# Altium project SVEC.PrjPcb (part 11 of 11)
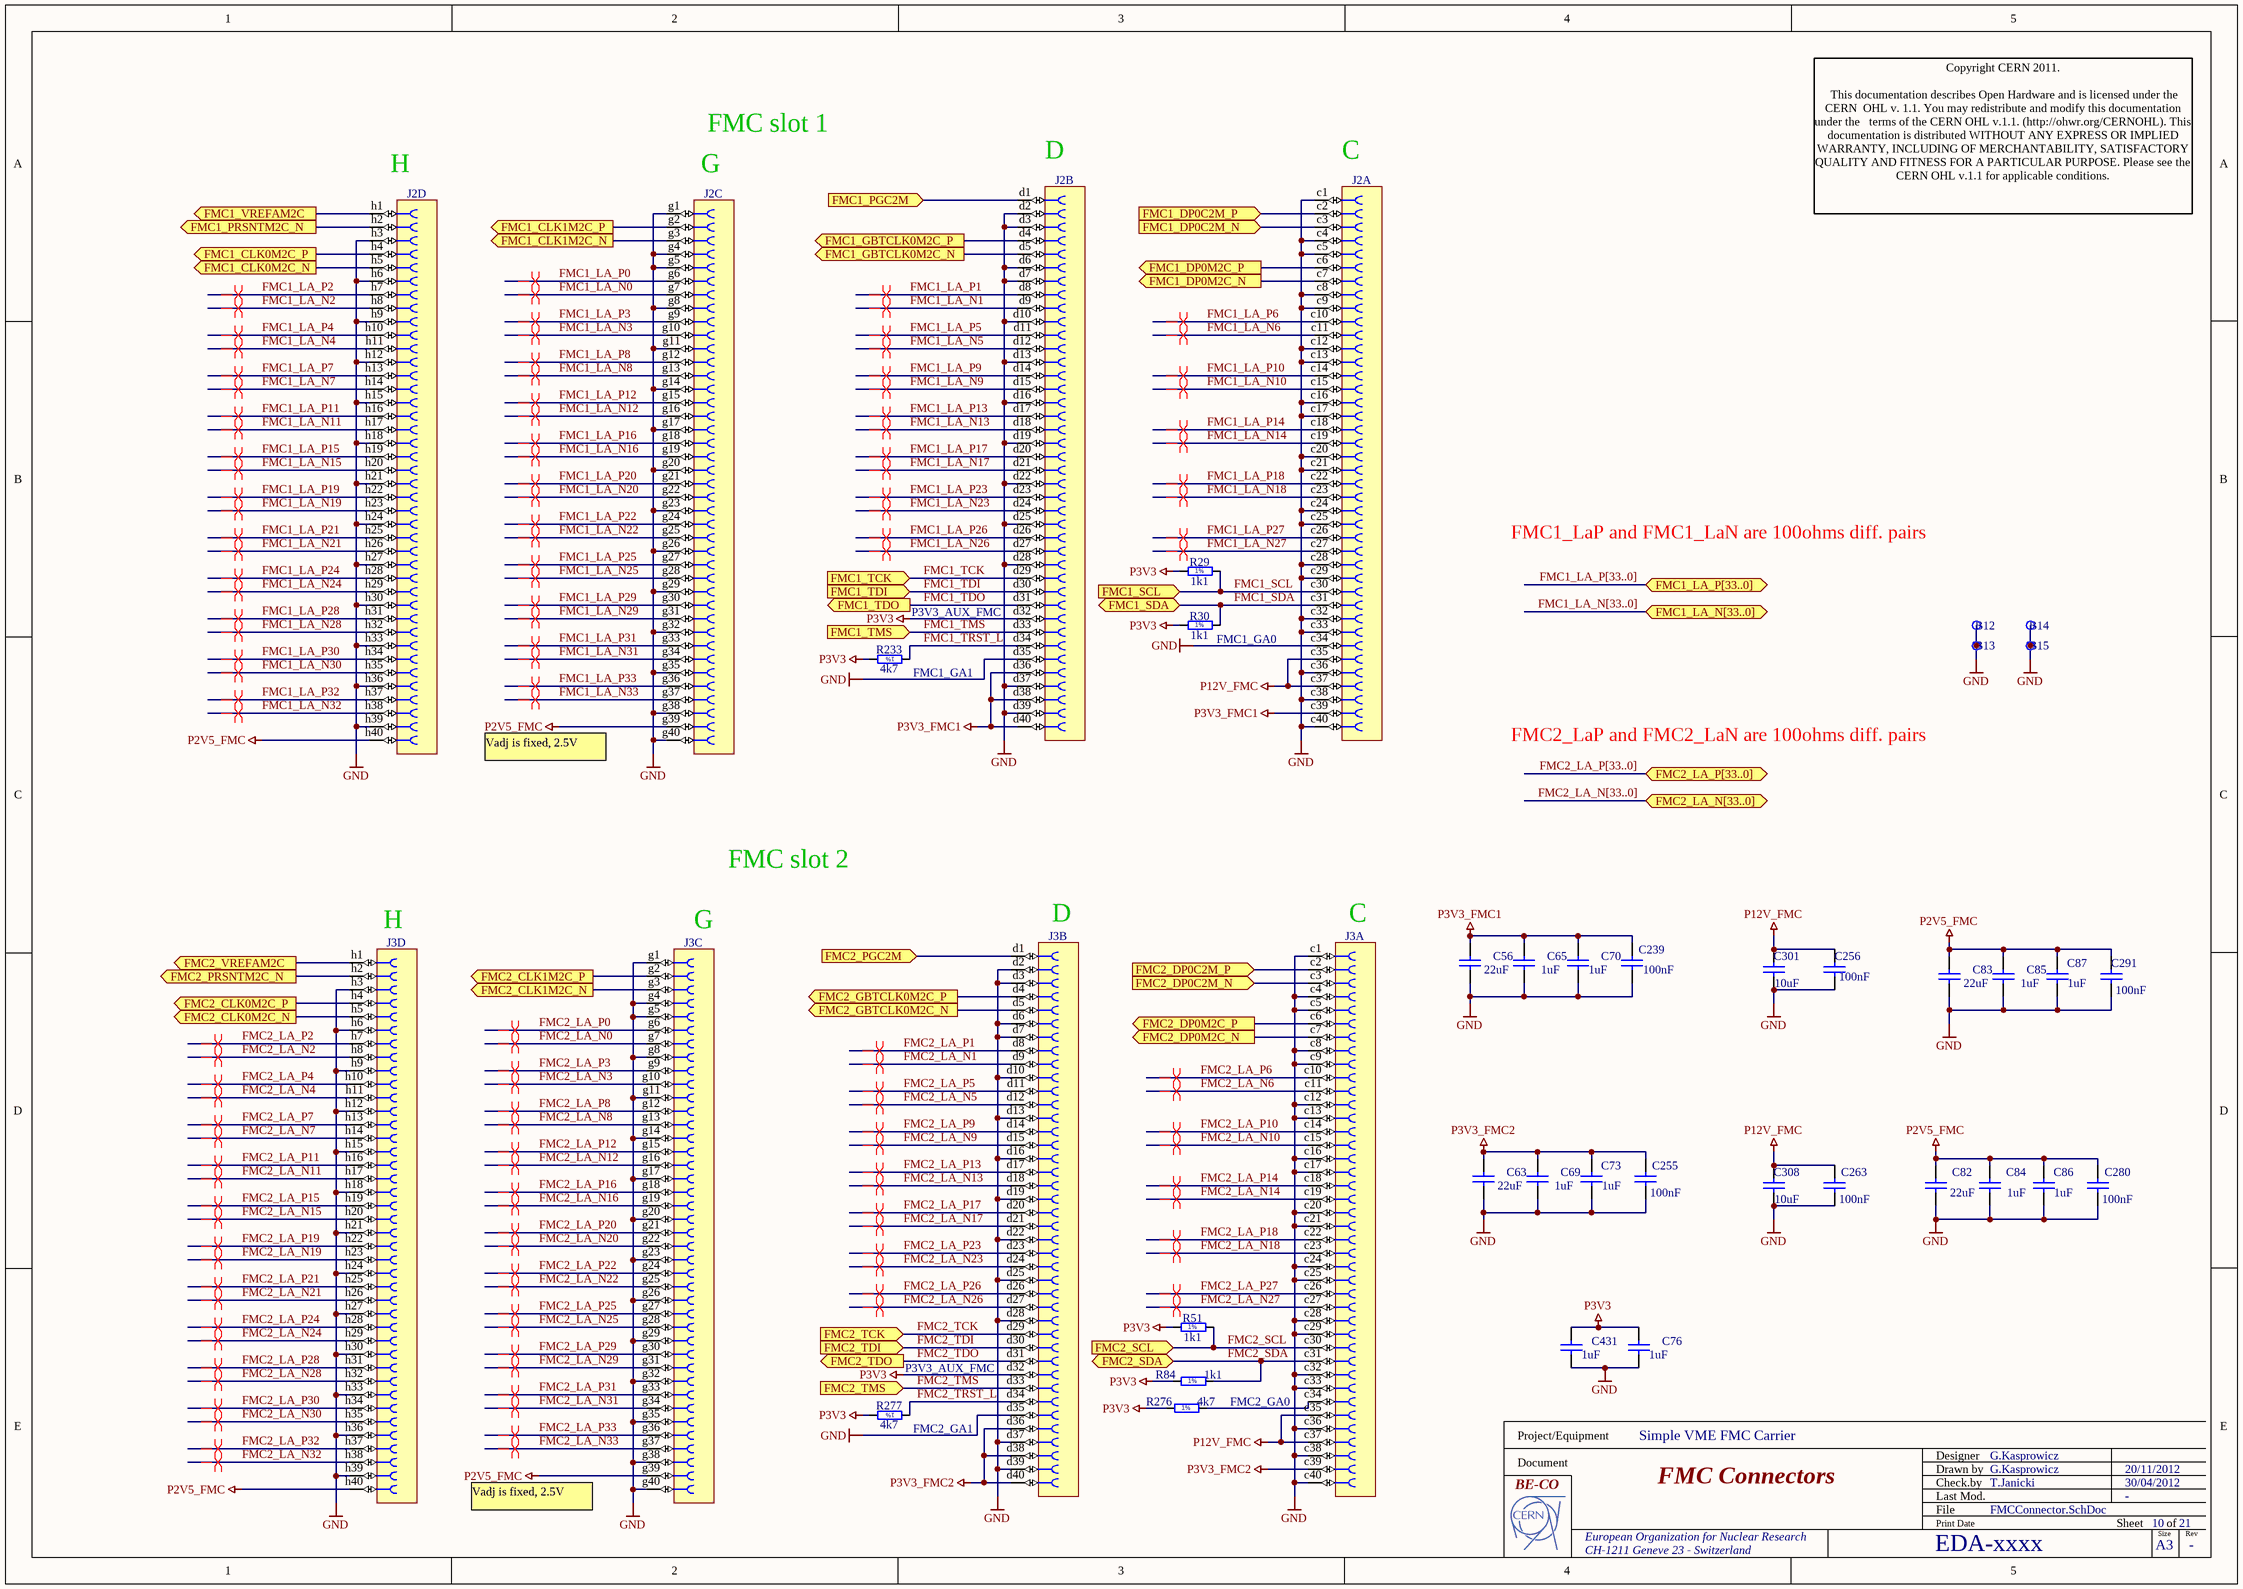
[diagram p20: FMC_connectors.SchDoc]

## Nets that join several sheets
GND: Front_panel (80 pins), SFPGA (9 pins), Clk_generation (75 pins), JTAG chain + SFPGA flash (18 pins), FPGA_GTP (44 pins), USB_interface (38 pins), AFPGA_FMC1_bank0 (5 pins), AFPGA_FMC2_bank2 (10 pins), DDR3 (50 pins), DDR3_2 (49 pins), AFPGA_VME_IO_banks1+3 (IC13.4), VME_connectors (79 pins), VME_buffers (42 pins), VME_buffers_address (83 pins), SFPGA_power (56 pins), AFPGA_power (224 pins), Power_supplies (100 pins), FMC_connectors (151 pins)
P1V2: FPGA_GTP (L8.1 L9.1), SFPGA_power (18 pins), AFPGA_power (49 pins), Power_supplies (17 pins)
P1V5: DDR3 (27 pins), DDR3_2 (27 pins), AFPGA_power (24 pins), Power_supplies (10 pins)
P1V8: USB_interface (7 pins), Power_supplies (B2.1)
P2V5: JTAG chain + SFPGA flash (5 pins), AFPGA_FMC1_bank0 (R14.2), AFPGA_FMC2_bank2 (6 pins), AFPGA_power (46 pins), Power_supplies (10 pins)
P2V5_FMC: Power_supplies (10 pins), FMC_connectors (12 pins)
P3V3: Front_panel (40 pins), SFPGA (11 pins), Clk_generation (6 pins), JTAG chain + SFPGA flash (21 pins), FPGA_GTP (J16.P1 J16.P2 J16.P3), USB_interface (24 pins), AFPGA_VME_IO_banks1+3 (10 pins), VME_connectors (10 pins), VME_buffers (41 pins), VME_buffers_address (70 pins), SFPGA_power (48 pins), AFPGA_power (83 pins), Power_supplies (10 pins), FMC_connectors (11 pins)
P3V3_FMC1: Power_supplies (F3.2), FMC_connectors (8 pins)
P3V3_FMC2: Power_supplies (F4.2), FMC_connectors (8 pins)
P5V_VME: FPGA_GTP (J16.P7 J16.P8 J16.P9), VME_connectors (6 pins), Power_supplies (29 pins)
P12V_FMC: Power_supplies (C241.1 C412.1 F1.2), FMC_connectors (8 pins)
VREF_DDR3: DDR3 (9 pins), DDR3_2 (7 pins), Power_supplies (C68.2 IC8.6)
VTT_DDR3: DDR3 (52 pins), DDR3_2 (53 pins), Power_supplies (C62.2 C180.2 IC8.3 IC8.5)
2V5_AFPGA_CCLK: JTAG chain + SFPGA flash (R202.2), AFPGA_FMC2_bank2 (IC19.AJ26)
2V5_AFPGA_CSO_B: JTAG chain + SFPGA flash (B7.1), AFPGA_FMC2_bank2 (IC19.AK6)
2V5_AFPGA_INIT_B: JTAG chain + SFPGA flash (R199.1 R259.2), AFPGA_FMC2_bank2 (IC19.AJ6)
2V5_AFPGA_MISO: JTAG chain + SFPGA flash (R118.2), AFPGA_FMC2_bank2 (IC19.AJ25)
2V5_AFPGA_MOSI: JTAG chain + SFPGA flash (B3.1), AFPGA_FMC2_bank2 (IC19.AK25)
2V5_AFPGA_PROGRAM: JTAG chain + SFPGA flash (R145.1 R192.1), AFPGA_FMC2_bank2 (IC19.AB8)
AFPGA_DONE: JTAG chain + SFPGA flash (R200.1 R260.2 T8.1), AFPGA_FMC2_bank2 (IC19.AD25)
AFPGA_M0: JTAG chain + SFPGA flash (R93.1), AFPGA_FMC2_bank2 (IC19.AK26)
AFPGA_M1: JTAG chain + SFPGA flash (R119.1), AFPGA_FMC2_bank2 (IC19.AG24)
BOOT_CLK: SFPGA (IC40.F14), JTAG chain + SFPGA flash (R202.1)
BOOT_CONFIG: SFPGA (IC40.C15), JTAG chain + SFPGA flash (R145.2)
BOOT_DONE: SFPGA (IC40.C16), JTAG chain + SFPGA flash (R260.1)
BOOT_DOUT: SFPGA (IC40.F13), JTAG chain + SFPGA flash (R118.1)
BOOT_STATUS: SFPGA (IC40.E16), JTAG chain + SFPGA flash (R259.1)
CLK20_VCXO: Clk_generation (R27.2), AFPGA_VME_IO_banks1+3 (IC19.V26)
FMC1_CLK0M2C_N: AFPGA_FMC1_bank0 (IC19.G15), FMC_connectors (J2.h5)
FMC1_CLK0M2C_P: AFPGA_FMC1_bank0 (IC19.H15), FMC_connectors (J2.h4)
FMC1_CLK1M2C_N: AFPGA_FMC1_bank0 (IC19.D16), FMC_connectors (J2.g3)
FMC1_CLK1M2C_P: AFPGA_FMC1_bank0 (IC19.E16), FMC_connectors (J2.g2)
FMC1_DP0C2M_N: FPGA_GTP (IC19.A9), FMC_connectors (J2.c3)
FMC1_DP0C2M_P: FPGA_GTP (IC19.B9), FMC_connectors (J2.c2)
FMC1_DP0M2C_N: FPGA_GTP (IC19.C10), FMC_connectors (J2.c7)
FMC1_DP0M2C_P: FPGA_GTP (IC19.D10), FMC_connectors (J2.c6)
FMC1_GBTCLK0M2C_N: FPGA_GTP (IC19.A13), FMC_connectors (J2.d5)
FMC1_GBTCLK0M2C_P: FPGA_GTP (IC19.B13), FMC_connectors (J2.d4)
FMC1_LA_N0: AFPGA_FMC1_bank0 (IC19.A16), FMC_connectors (J2.g7)
FMC1_LA_N1: AFPGA_FMC1_bank0 (IC19.G21), FMC_connectors (J2.d9)
FMC1_LA_N2: AFPGA_FMC1_bank0 (IC19.H22), FMC_connectors (J2.h8)
FMC1_LA_N3: AFPGA_FMC1_bank0 (IC19.D25), FMC_connectors (J2.g10)
FMC1_LA_N4: AFPGA_FMC1_bank0 (IC19.C24), FMC_connectors (J2.h11)
FMC1_LA_N5: AFPGA_FMC1_bank0 (IC19.L19), FMC_connectors (J2.d12)
FMC1_LA_N6: AFPGA_FMC1_bank0 (IC19.A25), FMC_connectors (J2.c11)
FMC1_LA_N7: AFPGA_FMC1_bank0 (IC19.F22), FMC_connectors (J2.h14)
FMC1_LA_N8: AFPGA_FMC1_bank0 (IC19.E23), FMC_connectors (J2.g13)
FMC1_LA_N9: AFPGA_FMC1_bank0 (IC19.L20), FMC_connectors (J2.d15)
FMC1_LA_N10: AFPGA_FMC1_bank0 (IC19.K21), FMC_connectors (J2.c15)
FMC1_LA_N11: AFPGA_FMC1_bank0 (IC19.F20), FMC_connectors (J2.h17)
FMC1_LA_N12: AFPGA_FMC1_bank0 (IC19.E21), FMC_connectors (J2.g16)
FMC1_LA_N13: AFPGA_FMC1_bank0 (IC19.F18), FMC_connectors (J2.d18)
FMC1_LA_N14: AFPGA_FMC1_bank0 (IC19.E17), FMC_connectors (J2.c19)
FMC1_LA_N15: AFPGA_FMC1_bank0 (IC19.G16), FMC_connectors (J2.h20)
FMC1_LA_N16: AFPGA_FMC1_bank0 (IC19.E19), FMC_connectors (J2.g19)
FMC1_LA_N17: AFPGA_FMC1_bank0 (IC19.A15), FMC_connectors (J2.d21)
FMC1_LA_N18: AFPGA_FMC1_bank0 (IC19.H14), FMC_connectors (J2.c23)
FMC1_LA_N19: AFPGA_FMC1_bank0 (IC19.F14), FMC_connectors (J2.h23)
FMC1_LA_N20: AFPGA_FMC1_bank0 (IC19.E15), FMC_connectors (J2.g22)
FMC1_LA_N21: AFPGA_FMC1_bank0 (IC19.F12), FMC_connectors (J2.h26)
FMC1_LA_N22: AFPGA_FMC1_bank0 (IC19.E13), FMC_connectors (J2.g25)
FMC1_LA_N23: AFPGA_FMC1_bank0 (IC19.K15), FMC_connectors (J2.d24)
FMC1_LA_N24: AFPGA_FMC1_bank0 (IC19.F10), FMC_connectors (J2.h29)
FMC1_LA_N25: AFPGA_FMC1_bank0 (IC19.E11), FMC_connectors (J2.g28)
FMC1_LA_N26: AFPGA_FMC1_bank0 (IC19.K14), FMC_connectors (J2.d27)
FMC1_LA_N27: AFPGA_FMC1_bank0 (IC19.L13), FMC_connectors (J2.c27)
FMC1_LA_N28: AFPGA_FMC1_bank0 (IC19.K12), FMC_connectors (J2.h32)
FMC1_LA_N29: AFPGA_FMC1_bank0 (IC19.E9), FMC_connectors (J2.g31)
FMC1_LA_N30: AFPGA_FMC1_bank0 (IC19.H13), FMC_connectors (J2.h35)
FMC1_LA_N31: AFPGA_FMC1_bank0 (IC19.K11), FMC_connectors (J2.g34)
FMC1_LA_N32: AFPGA_FMC1_bank0 (IC19.G11), FMC_connectors (J2.h38)
FMC1_LA_N33: AFPGA_FMC1_bank0 (IC19.H12), FMC_connectors (J2.g37)
FMC1_LA_P0: AFPGA_FMC1_bank0 (IC19.C16), FMC_connectors (J2.g6)
FMC1_LA_P1: AFPGA_FMC1_bank0 (IC19.H21), FMC_connectors (J2.d8)
FMC1_LA_P2: AFPGA_FMC1_bank0 (IC19.J22), FMC_connectors (J2.h7)
FMC1_LA_P3: AFPGA_FMC1_bank0 (IC19.E25), FMC_connectors (J2.g9)
FMC1_LA_P4: AFPGA_FMC1_bank0 (IC19.D24), FMC_connectors (J2.h10)
FMC1_LA_P5: AFPGA_FMC1_bank0 (IC19.M19), FMC_connectors (J2.d11)
FMC1_LA_P6: AFPGA_FMC1_bank0 (IC19.B25), FMC_connectors (J2.c10)
FMC1_LA_P7: AFPGA_FMC1_bank0 (IC19.G22), FMC_connectors (J2.h13)
FMC1_LA_P8: AFPGA_FMC1_bank0 (IC19.F23), FMC_connectors (J2.g12)
FMC1_LA_P9: AFPGA_FMC1_bank0 (IC19.M20), FMC_connectors (J2.d14)
FMC1_LA_P10: AFPGA_FMC1_bank0 (IC19.L21), FMC_connectors (J2.c14)
FMC1_LA_P11: AFPGA_FMC1_bank0 (IC19.G20), FMC_connectors (J2.h16)
FMC1_LA_P12: AFPGA_FMC1_bank0 (IC19.F21), FMC_connectors (J2.g15)
FMC1_LA_P13: AFPGA_FMC1_bank0 (IC19.G18), FMC_connectors (J2.d17)
FMC1_LA_P14: AFPGA_FMC1_bank0 (IC19.F17), FMC_connectors (J2.c18)
FMC1_LA_P15: AFPGA_FMC1_bank0 (IC19.H16), FMC_connectors (J2.h19)
FMC1_LA_P16: AFPGA_FMC1_bank0 (IC19.F19), FMC_connectors (J2.g18)
FMC1_LA_P17: AFPGA_FMC1_bank0 (IC19.B15), FMC_connectors (J2.d20)
FMC1_LA_P18: AFPGA_FMC1_bank0 (IC19.J14), FMC_connectors (J2.c22)
FMC1_LA_P19: AFPGA_FMC1_bank0 (IC19.G14), FMC_connectors (J2.h22)
FMC1_LA_P20: AFPGA_FMC1_bank0 (IC19.F15), FMC_connectors (J2.g21)
FMC1_LA_P21: AFPGA_FMC1_bank0 (IC19.G12), FMC_connectors (J2.h25)
FMC1_LA_P22: AFPGA_FMC1_bank0 (IC19.F13), FMC_connectors (J2.g24)
FMC1_LA_P23: AFPGA_FMC1_bank0 (IC19.M15), FMC_connectors (J2.d23)
FMC1_LA_P24: AFPGA_FMC1_bank0 (IC19.G10), FMC_connectors (J2.h28)
FMC1_LA_P25: AFPGA_FMC1_bank0 (IC19.F11), FMC_connectors (J2.g27)
FMC1_LA_P26: AFPGA_FMC1_bank0 (IC19.L14), FMC_connectors (J2.d26)
FMC1_LA_P27: AFPGA_FMC1_bank0 (IC19.M13), FMC_connectors (J2.c26)
FMC1_LA_P28: AFPGA_FMC1_bank0 (IC19.L12), FMC_connectors (J2.h31)
FMC1_LA_P29: AFPGA_FMC1_bank0 (IC19.F9), FMC_connectors (J2.g30)
FMC1_LA_P30: AFPGA_FMC1_bank0 (IC19.J13), FMC_connectors (J2.h34)
FMC1_LA_P31: AFPGA_FMC1_bank0 (IC19.L11), FMC_connectors (J2.g33)
FMC1_LA_P32: AFPGA_FMC1_bank0 (IC19.H11), FMC_connectors (J2.h37)
FMC1_LA_P33: AFPGA_FMC1_bank0 (IC19.J12), FMC_connectors (J2.g36)
FMC1_PGC2M: AFPGA_VME_IO_banks1+3 (R212.2), FMC_connectors (J2.d1)
FMC1_PRSNTM2C_N: AFPGA_VME_IO_banks1+3 (IC19.N30 R137.1), FMC_connectors (J2.h2)
FMC1_SCL: AFPGA_VME_IO_banks1+3 (IC19.P28), FMC_connectors (J2.c30 R29.2)
FMC1_SDA: AFPGA_VME_IO_banks1+3 (IC19.P30), FMC_connectors (J2.c31 R30.2)
FMC1_TCK: AFPGA_VME_IO_banks1+3 (IC19.AJ30), FMC_connectors (J2.d29)
FMC1_TDI: AFPGA_VME_IO_banks1+3 (IC19.AG30), FMC_connectors (J2.d30)
FMC1_TDO: AFPGA_VME_IO_banks1+3 (IC19.AF30), FMC_connectors (J2.d31)
FMC1_TMS: AFPGA_VME_IO_banks1+3 (IC19.AE25), FMC_connectors (J2.d33)
FMC1_VREFAM2C: AFPGA_FMC1_bank0 (8 pins), FMC_connectors (J2.h1)
FMC2_CLK0M2C_N: AFPGA_FMC2_bank2 (IC19.AG16), FMC_connectors (J3.h5)
FMC2_CLK0M2C_P: AFPGA_FMC2_bank2 (IC19.AF16), FMC_connectors (J3.h4)
FMC2_CLK1M2C_N: AFPGA_FMC2_bank2 (IC19.AK16), FMC_connectors (J3.g3)
FMC2_CLK1M2C_P: AFPGA_FMC2_bank2 (IC19.AH16), FMC_connectors (J3.g2)
FMC2_DP0C2M_N: FPGA_GTP (IC19.AK21), FMC_connectors (J3.c3)
FMC2_DP0C2M_P: FPGA_GTP (IC19.AJ21), FMC_connectors (J3.c2)
FMC2_DP0M2C_N: FPGA_GTP (IC19.AH20), FMC_connectors (J3.c7)
FMC2_DP0M2C_P: FPGA_GTP (IC19.AG20), FMC_connectors (J3.c6)
FMC2_GBTCLK0M2C_N: FPGA_GTP (IC19.AH18), FMC_connectors (J3.d5)
FMC2_GBTCLK0M2C_P: FPGA_GTP (IC19.AG18), FMC_connectors (J3.d4)
FMC2_LA_N0: AFPGA_FMC2_bank2 (IC19.AK17), FMC_connectors (J3.g7)
FMC2_LA_N1: AFPGA_FMC2_bank2 (IC19.AH8), FMC_connectors (J3.d9)
FMC2_LA_N2: AFPGA_FMC2_bank2 (IC19.AD11), FMC_connectors (J3.h8)
FMC2_LA_N3: AFPGA_FMC2_bank2 (IC19.AF13), FMC_connectors (J3.g10)
FMC2_LA_N4: AFPGA_FMC2_bank2 (IC19.AK15), FMC_connectors (J3.h11)
FMC2_LA_N5: AFPGA_FMC2_bank2 (IC19.AF11), FMC_connectors (J3.d12)
FMC2_LA_N6: AFPGA_FMC2_bank2 (IC19.AE10), FMC_connectors (J3.c11)
FMC2_LA_N7: AFPGA_FMC2_bank2 (IC19.AE12), FMC_connectors (J3.h14)
FMC2_LA_N8: AFPGA_FMC2_bank2 (IC19.AC12), FMC_connectors (J3.g13)
FMC2_LA_N9: AFPGA_FMC2_bank2 (IC19.Y13), FMC_connectors (J3.d15)
FMC2_LA_N10: AFPGA_FMC2_bank2 (IC19.AA14), FMC_connectors (J3.c15)
FMC2_LA_N11: AFPGA_FMC2_bank2 (IC19.AB16), FMC_connectors (J3.h17)
FMC2_LA_N12: AFPGA_FMC2_bank2 (IC19.AF15), FMC_connectors (J3.g16)
FMC2_LA_N13: AFPGA_FMC2_bank2 (IC19.AD15), FMC_connectors (J3.d18)
FMC2_LA_N14: AFPGA_FMC2_bank2 (IC19.AA15), FMC_connectors (J3.c19)
FMC2_LA_N15: AFPGA_FMC2_bank2 (IC19.AA17), FMC_connectors (J3.h20)
FMC2_LA_N16: AFPGA_FMC2_bank2 (IC19.AC14), FMC_connectors (J3.g19)
FMC2_LA_N17: AFPGA_FMC2_bank2 (IC19.AD16), FMC_connectors (J3.d21)
FMC2_LA_N18: AFPGA_FMC2_bank2 (IC19.AF21), FMC_connectors (J3.c23)
FMC2_LA_N19: AFPGA_FMC2_bank2 (IC19.AF23), FMC_connectors (J3.h23)
FMC2_LA_N20: AFPGA_FMC2_bank2 (IC19.AF19), FMC_connectors (J3.g22)
FMC2_LA_N21: AFPGA_FMC2_bank2 (IC19.AE22), FMC_connectors (J3.h26)
FMC2_LA_N22: AFPGA_FMC2_bank2 (IC19.AF24), FMC_connectors (J3.g25)
FMC2_LA_N23: AFPGA_FMC2_bank2 (IC19.AG25), FMC_connectors (J3.d24)
FMC2_LA_N24: AFPGA_FMC2_bank2 (IC19.AC21), FMC_connectors (J3.h29)
FMC2_LA_N25: AFPGA_FMC2_bank2 (IC19.AD17), FMC_connectors (J3.g28)
FMC2_LA_N26: AFPGA_FMC2_bank2 (IC19.AD19), FMC_connectors (J3.d27)
FMC2_LA_N27: AFPGA_FMC2_bank2 (IC19.AC20), FMC_connectors (J3.c27)
FMC2_LA_N28: AFPGA_FMC2_bank2 (IC19.AC22), FMC_connectors (J3.h32)
FMC2_LA_N29: AFPGA_FMC2_bank2 (IC19.AD24), FMC_connectors (J3.g31)
FMC2_LA_N30: AFPGA_FMC2_bank2 (IC19.Y20), FMC_connectors (J3.h35)
FMC2_LA_N31: AFPGA_FMC2_bank2 (IC19.AA21), FMC_connectors (J3.g34)
FMC2_LA_N32: AFPGA_FMC2_bank2 (IC19.Y19), FMC_connectors (J3.h38)
FMC2_LA_N33: AFPGA_FMC2_bank2 (IC19.AB19), FMC_connectors (J3.g37)
FMC2_LA_P0: AFPGA_FMC2_bank2 (IC19.AJ17), FMC_connectors (J3.g6)
FMC2_LA_P1: AFPGA_FMC2_bank2 (IC19.AG8), FMC_connectors (J3.d8)
FMC2_LA_P2: AFPGA_FMC2_bank2 (IC19.AC11), FMC_connectors (J3.h7)
FMC2_LA_P3: AFPGA_FMC2_bank2 (IC19.AE13), FMC_connectors (J3.g9)
FMC2_LA_P4: AFPGA_FMC2_bank2 (IC19.AJ15), FMC_connectors (J3.h10)
FMC2_LA_P5: AFPGA_FMC2_bank2 (IC19.AE11), FMC_connectors (J3.d11)
FMC2_LA_P6: AFPGA_FMC2_bank2 (IC19.AD10), FMC_connectors (J3.c10)
FMC2_LA_P7: AFPGA_FMC2_bank2 (IC19.AD12), FMC_connectors (J3.h13)
FMC2_LA_P8: AFPGA_FMC2_bank2 (IC19.AB12), FMC_connectors (J3.g12)
FMC2_LA_P9: AFPGA_FMC2_bank2 (IC19.W14), FMC_connectors (J3.d14)
FMC2_LA_P10: AFPGA_FMC2_bank2 (IC19.Y14), FMC_connectors (J3.c14)
FMC2_LA_P11: AFPGA_FMC2_bank2 (IC19.Y16), FMC_connectors (J3.h16)
FMC2_LA_P12: AFPGA_FMC2_bank2 (IC19.AE15), FMC_connectors (J3.g15)
FMC2_LA_P13: AFPGA_FMC2_bank2 (IC19.AC15), FMC_connectors (J3.d17)
FMC2_LA_P14: AFPGA_FMC2_bank2 (IC19.Y15), FMC_connectors (J3.c18)
FMC2_LA_P15: AFPGA_FMC2_bank2 (IC19.Y17), FMC_connectors (J3.h19)
FMC2_LA_P16: AFPGA_FMC2_bank2 (IC19.AB14), FMC_connectors (J3.g18)
FMC2_LA_P17: AFPGA_FMC2_bank2 (IC19.AC16), FMC_connectors (J3.d20)
FMC2_LA_P18: AFPGA_FMC2_bank2 (IC19.AE21), FMC_connectors (J3.c22)
FMC2_LA_P19: AFPGA_FMC2_bank2 (IC19.AE23), FMC_connectors (J3.h22)
FMC2_LA_P20: AFPGA_FMC2_bank2 (IC19.AE19), FMC_connectors (J3.g21)
FMC2_LA_P21: AFPGA_FMC2_bank2 (IC19.AD22), FMC_connectors (J3.h25)
FMC2_LA_P22: AFPGA_FMC2_bank2 (IC19.AE24), FMC_connectors (J3.g24)
FMC2_LA_P23: AFPGA_FMC2_bank2 (IC19.AF25), FMC_connectors (J3.d23)
FMC2_LA_P24: AFPGA_FMC2_bank2 (IC19.AB21), FMC_connectors (J3.h28)
FMC2_LA_P25: AFPGA_FMC2_bank2 (IC19.AB17), FMC_connectors (J3.g27)
FMC2_LA_P26: AFPGA_FMC2_bank2 (IC19.AC19), FMC_connectors (J3.d26)
FMC2_LA_P27: AFPGA_FMC2_bank2 (IC19.AB20), FMC_connectors (J3.c26)
FMC2_LA_P28: AFPGA_FMC2_bank2 (IC19.AA22), FMC_connectors (J3.h31)
FMC2_LA_P29: AFPGA_FMC2_bank2 (IC19.AC24), FMC_connectors (J3.g30)
FMC2_LA_P30: AFPGA_FMC2_bank2 (IC19.W20), FMC_connectors (J3.h34)
FMC2_LA_P31: AFPGA_FMC2_bank2 (IC19.Y21), FMC_connectors (J3.g33)
FMC2_LA_P32: AFPGA_FMC2_bank2 (IC19.W19), FMC_connectors (J3.h37)
FMC2_LA_P33: AFPGA_FMC2_bank2 (IC19.AA19), FMC_connectors (J3.g36)
FMC2_PGC2M: AFPGA_VME_IO_banks1+3 (R240.2), FMC_connectors (J3.d1)
FMC2_PRSNTM2C_N: AFPGA_VME_IO_banks1+3 (IC19.AE29 R207.1), FMC_connectors (J3.h2)
FMC2_SCL: AFPGA_VME_IO_banks1+3 (IC19.W29), FMC_connectors (J3.c30 R51.2)
FMC2_SDA: AFPGA_VME_IO_banks1+3 (IC19.V30), FMC_connectors (J3.c31 R84.2)
FMC2_TCK: AFPGA_VME_IO_banks1+3 (IC19.AH30), FMC_connectors (J3.d29)
FMC2_TDI: AFPGA_VME_IO_banks1+3 (IC19.AK29), FMC_connectors (J3.d30)
FMC2_TDO: AFPGA_VME_IO_banks1+3 (IC19.AG29), FMC_connectors (J3.d31)
FMC2_TMS: AFPGA_VME_IO_banks1+3 (IC19.AJ29), FMC_connectors (J3.d33)
FMC2_VREFAM2C: AFPGA_FMC2_bank2 (10 pins), FMC_connectors (J3.h1)
FP_GPIO1: Front_panel (IC16.2 IC16.3 R196.2), AFPGA_VME_IO_banks1+3 (IC19.R30)
FP_GPIO2: Front_panel (IC16.5 IC16.6 R197.2), AFPGA_VME_IO_banks1+3 (IC19.T28)
FP_GPIO3: Front_panel (IC16.9 R198.2), AFPGA_VME_IO_banks1+3 (IC19.U29)
FP_GPIO4: Front_panel (IC16.19 R201.2), AFPGA_VME_IO_banks1+3 (IC19.V27)
FP_LEDN0: Front_panel (LD24.1), AFPGA_VME_IO_banks1+3 (IC19.AD27)
FP_LEDN1: Front_panel (LD24.3), AFPGA_VME_IO_banks1+3 (IC19.AD26)
FP_LEDN2: Front_panel (LD24.5), AFPGA_VME_IO_banks1+3 (IC19.AC28)
FP_LEDN3: Front_panel (LD24.7), AFPGA_VME_IO_banks1+3 (IC19.AC27)
FP_LEDN4: Front_panel (LD25.1), AFPGA_VME_IO_banks1+3 (IC19.AE27)
FP_LEDN5: Front_panel (LD25.3), AFPGA_VME_IO_banks1+3 (IC19.AE30)
FP_LEDN6: Front_panel (LD25.5), AFPGA_VME_IO_banks1+3 (IC19.AF28)
FP_LEDN7: Front_panel (LD25.7), AFPGA_VME_IO_banks1+3 (IC19.AE28)
FPGA_CLK_N: Clk_generation (IC6.28), AFPGA_VME_IO_banks1+3 (IC19.AB30)
FPGA_CLK_P: Clk_generation (IC6.29), AFPGA_VME_IO_banks1+3 (IC19.AB28)
FPGA_PLL_REF_CLK0_N: Clk_generation (IC6.5), FPGA_GTP (C162.1)
FPGA_PLL_REF_CLK0_P: Clk_generation (IC6.6), FPGA_GTP (C266.1)
FPGA_PLL_REF_CLK1_N: Clk_generation (IC6.2), FPGA_GTP (C267.1)
FPGA_PLL_REF_CLK1_P: Clk_generation (IC6.3), FPGA_GTP (C165.1)
FPGPIO1_A2B: Front_panel (IC16.1 IC16.48 R164.2), AFPGA_VME_IO_banks1+3 (IC19.R29)
FPGPIO2_A2B: Front_panel (IC16.8 IC16.41 R165.2), AFPGA_VME_IO_banks1+3 (IC19.T30)
FPGPIO34_A2B: Front_panel (IC16.24 R195.2), AFPGA_VME_IO_banks1+3 (IC19.V28)
IO7: USB_interface (IC37.34), AFPGA_VME_IO_banks1+3 (IC19.U30)
LCLK_N: SFPGA (IC40.H5), Clk_generation (R152.2)
NOGA0: SFPGA (IC40.E13 R133.1 SW1.1), AFPGA_VME_IO_banks1+3 (IC19.AE26)
NOGA1: SFPGA (IC40.E12 R136.1 SW1.2), AFPGA_VME_IO_banks1+3 (IC19.P23)
NOGA2: SFPGA (IC40.B15 R144.1 SW1.3), AFPGA_VME_IO_banks1+3 (IC19.Y24)
NOGA3: SFPGA (IC40.B16 R149.1 SW1.4), AFPGA_VME_IO_banks1+3 (IC19.Y23)
NOGA4: SFPGA (IC40.F12 R151.1 SW1.5), AFPGA_VME_IO_banks1+3 (IC19.V23)
OE_SI57X: Clk_generation (OSC3.2 R20.1), AFPGA_VME_IO_banks1+3 (IC19.Y28)
P2_DATA_N0: AFPGA_FMC2_bank2 (IC19.AB11), VME_connectors (P3.a3)
P2_DATA_N1: AFPGA_FMC2_bank2 (IC19.Y12), VME_connectors (P3.a6)
P2_DATA_N2: AFPGA_FMC2_bank2 (IC19.AB9), VME_connectors (P3.a9)
P2_DATA_N3: AFPGA_FMC2_bank2 (IC19.AK7), VME_connectors (P3.a12)
P2_DATA_N4: AFPGA_FMC1_bank0 (IC19.E6), VME_connectors (P3.a15)
P2_DATA_N5: AFPGA_FMC1_bank0 (IC19.G7), VME_connectors (P3.a18)
P2_DATA_N6: AFPGA_FMC1_bank0 (IC19.C8), VME_connectors (P3.a21)
P2_DATA_N7: AFPGA_FMC1_bank0 (IC19.H8), VME_connectors (P3.a24)
P2_DATA_N8: AFPGA_FMC1_bank0 (IC19.K17), VME_connectors (P3.a27)
P2_DATA_N9: AFPGA_FMC1_bank0 (IC19.L10), VME_connectors (P3.a30)
P2_DATA_N10: AFPGA_FMC2_bank2 (IC19.AG7), VME_connectors (P3.d3)
P2_DATA_N11: AFPGA_FMC2_bank2 (IC19.AH6), VME_connectors (P3.d6)
P2_DATA_N12: AFPGA_FMC2_bank2 (IC19.AE8), VME_connectors (P3.d9)
P2_DATA_N13: AFPGA_FMC2_bank2 (IC19.AF9), VME_connectors (P3.d12)
P2_DATA_N14: AFPGA_FMC1_bank0 (IC19.C6), VME_connectors (P3.d15)
P2_DATA_N15: AFPGA_FMC1_bank0 (IC19.D7), VME_connectors (P3.d18)
P2_DATA_N16: AFPGA_FMC1_bank0 (IC19.E8), VME_connectors (P3.d21)
P2_DATA_N17: AFPGA_FMC1_bank0 (IC19.G17), VME_connectors (P3.d24)
P2_DATA_N18: AFPGA_FMC1_bank0 (IC19.J10), VME_connectors (P3.d27)
P2_DATA_N19: AFPGA_FMC1_bank0 (IC19.A7), VME_connectors (P3.d30)
P2_DATA_P0: AFPGA_FMC2_bank2 (IC19.AA11), VME_connectors (P3.a2)
P2_DATA_P1: AFPGA_FMC2_bank2 (IC19.W12), VME_connectors (P3.a5)
P2_DATA_P2: AFPGA_FMC2_bank2 (IC19.AB10), VME_connectors (P3.a8)
P2_DATA_P3: AFPGA_FMC2_bank2 (IC19.AH7), VME_connectors (P3.a11)
P2_DATA_P4: AFPGA_FMC1_bank0 (IC19.F6), VME_connectors (P3.a14)
P2_DATA_P5: AFPGA_FMC1_bank0 (IC19.H7), VME_connectors (P3.a17)
P2_DATA_P6: AFPGA_FMC1_bank0 (IC19.D8), VME_connectors (P3.a20)
P2_DATA_P7: AFPGA_FMC1_bank0 (IC19.J8), VME_connectors (P3.a23)
P2_DATA_P8: AFPGA_FMC1_bank0 (IC19.L17), VME_connectors (P3.a26)
P2_DATA_P9: AFPGA_FMC1_bank0 (IC19.M10), VME_connectors (P3.a29)
P2_DATA_P10: AFPGA_FMC2_bank2 (IC19.AF7), VME_connectors (P3.d2)
P2_DATA_P11: AFPGA_FMC2_bank2 (IC19.AG6), VME_connectors (P3.d5)
P2_DATA_P12: AFPGA_FMC2_bank2 (IC19.AD8), VME_connectors (P3.d8)
P2_DATA_P13: AFPGA_FMC2_bank2 (IC19.AE9), VME_connectors (P3.d11)
P2_DATA_P14: AFPGA_FMC1_bank0 (IC19.D6), VME_connectors (P3.d14)
P2_DATA_P15: AFPGA_FMC1_bank0 (IC19.E7), VME_connectors (P3.d17)
P2_DATA_P16: AFPGA_FMC1_bank0 (IC19.F8), VME_connectors (P3.d20)
P2_DATA_P17: AFPGA_FMC1_bank0 (IC19.H17), VME_connectors (P3.d23)
P2_DATA_P18: AFPGA_FMC1_bank0 (IC19.K10), VME_connectors (P3.d26)
P2_DATA_P19: AFPGA_FMC1_bank0 (IC19.B7), VME_connectors (P3.d29)
P2_PLLFMC1_CLK_N: Clk_generation (C54.1), VME_connectors (P3.c26)
P2_PLLFMC1_CLK_P: Clk_generation (C36.1), VME_connectors (P3.c25)
P2_PLLFMC2_CLK_N: Clk_generation (C213.1), VME_connectors (P3.c30)
P2_PLLFMC2_CLK_P: Clk_generation (C74.1), VME_connectors (P3.c29)
PLL20DAC_DIN: Clk_generation (IC3.7), AFPGA_VME_IO_banks1+3 (IC19.U28)
PLL20DAC_SCLK: Clk_generation (IC3.6), AFPGA_VME_IO_banks1+3 (IC19.AA28)
PLL20DAC_SYNC_N: Clk_generation (IC3.5), AFPGA_VME_IO_banks1+3 (IC19.N28)
PLL25DAC_DIN: Clk_generation (IC7.7), AFPGA_VME_IO_banks1+3 (IC19.P25)
PLL25DAC_SCLK: Clk_generation (IC7.6), AFPGA_VME_IO_banks1+3 (IC19.N27)
PLL25DAC_SYNC_N: Clk_generation (IC7.5), AFPGA_VME_IO_banks1+3 (IC19.P26)
PLL_2AFPGA_N: Clk_generation (IC12.28), AFPGA_VME_IO_banks1+3 (IC19.AA1)
PLL_2AFPGA_P: Clk_generation (IC12.29), AFPGA_VME_IO_banks1+3 (IC19.AA3)
PLL_2SFPGA_N: SFPGA (IC40.F16), Clk_generation (IC12.31)
PLL_2SFPGA_P: SFPGA (IC40.F15), Clk_generation (IC12.32)
PLL_CE: SFPGA (IC40.G14), Clk_generation (IC6.7 IC12.7)
PUSHBUTTON: Front_panel (C279.2 PB1.2 R86.2), SFPGA (IC40.N16), AFPGA_VME_IO_banks1+3 (IC19.P24)
RST_N: SFPGA (IC40.E15), AFPGA_VME_IO_banks1+3 (IC19.AD28), Power_supplies (IC23.2)
RSVD0: SFPGA (IC40.G16), AFPGA_VME_IO_banks1+3 (IC19.AG26)
RSVD1: SFPGA (IC40.H15), AFPGA_VME_IO_banks1+3 (IC19.AH26)
RSVD2: SFPGA (IC40.H16), AFPGA_VME_IO_banks1+3 (IC19.AG27)
RSVD3: SFPGA (IC40.J14), AFPGA_VME_IO_banks1+3 (IC19.AH27)
RSVD4: SFPGA (IC40.J16), AFPGA_VME_IO_banks1+3 (IC19.AK27)
RSVD5: SFPGA (IC40.K15), AFPGA_VME_IO_banks1+3 (IC19.AG28)
RSVD6: SFPGA (IC40.K16), AFPGA_VME_IO_banks1+3 (IC19.AJ28)
RSVD7: SFPGA (IC40.M15), AFPGA_VME_IO_banks1+3 (IC19.AK28)
SCL_AFPGA: JTAG chain + SFPGA flash (IC31.6 R124.2), AFPGA_VME_IO_banks1+3 (IC19.AC29)
SDA_AFPGA: JTAG chain + SFPGA flash (IC31.5 R123.2), AFPGA_VME_IO_banks1+3 (IC19.AA30)
SFP_CLK_N: Front_panel (IC20.4 R105.2), Clk_generation (IC6.31)
SFP_CLK_P: Front_panel (IC20.3 R105.1), Clk_generation (IC6.32)
SFPGA_CCLK: SFPGA (IC40.R11), JTAG chain + SFPGA flash (IC14.6)
SFPGA_CSO_B: SFPGA (IC40.T3), JTAG chain + SFPGA flash (IC14.1 R238.1)
SFPGA_INIT_B: SFPGA (IC40.R3), JTAG chain + SFPGA flash (B4.1 R286.1)
SFPGA_M0: SFPGA (IC40.T11), JTAG chain + SFPGA flash (R219.2)
SFPGA_M1: SFPGA (IC40.N11), JTAG chain + SFPGA flash (R220.1)
SFPGA_MISO: SFPGA (IC40.P10), JTAG chain + SFPGA flash (R274.2)
SFPGA_MOSI: SFPGA (IC40.T10), JTAG chain + SFPGA flash (IC14.5)
SFPRX_123_N: Front_panel (J4.12), FPGA_GTP (IC19.C22)
SFPRX_123_P: Front_panel (J4.13), FPGA_GTP (IC19.D22)
SFPTX_123_N: Front_panel (J4.19), FPGA_GTP (IC19.A23)
SFPTX_123_P: Front_panel (J4.18), FPGA_GTP (IC19.B23)
SI57X_CLK_N: Clk_generation (OSC3.5), AFPGA_VME_IO_banks1+3 (IC19.W28)
SI57X_CLK_P: Clk_generation (OSC3.4), AFPGA_VME_IO_banks1+3 (IC19.W27)
SI57X_SCL: Clk_generation (OSC3.8 R18.1), AFPGA_VME_IO_banks1+3 (IC19.Y30)
SI57X_SDA: Clk_generation (OSC3.7 R19.1), AFPGA_VME_IO_banks1+3 (IC19.AA29)
SI57X_TUNE: Clk_generation (R16.2), AFPGA_VME_IO_banks1+3 (IC19.W30)
SWITCH0: SFPGA (IC40.D14 R160.1 SW1.7), AFPGA_VME_IO_banks1+3 (IC19.W22)
SWITCH1: SFPGA (IC40.D16 R161.1 SW1.8), AFPGA_VME_IO_banks1+3 (IC19.W21)
TERM_EN1: Front_panel (R205.2 T1.1), AFPGA_VME_IO_banks1+3 (IC19.AB1)
TERM_EN2: Front_panel (R204.2 T2.1), AFPGA_VME_IO_banks1+3 (IC19.W5)
TERM_EN3: Front_panel (R208.2 T6.1), AFPGA_VME_IO_banks1+3 (IC19.W4)
TERM_EN4: Front_panel (R206.2 T5.1), AFPGA_VME_IO_banks1+3 (IC19.V4)
UART_RXD: USB_interface (IC17.24), AFPGA_VME_IO_banks1+3 (IC19.U27)
UART_TXD: USB_interface (IC17.25), AFPGA_VME_IO_banks1+3 (IC19.U25)
USB_CLKOUT: USB_interface (IC37.32), AFPGA_VME_IO_banks1+3 (IC19.V24)
USB_D0: USB_interface (IC37.16), AFPGA_VME_IO_banks1+3 (IC19.P27)
USB_D1: USB_interface (IC37.17), AFPGA_VME_IO_banks1+3 (IC19.R24)
USB_D2: USB_interface (IC37.18), AFPGA_VME_IO_banks1+3 (IC19.R25)
USB_D3: USB_interface (IC37.19), AFPGA_VME_IO_banks1+3 (IC19.R27)
USB_D4: USB_interface (IC37.21), AFPGA_VME_IO_banks1+3 (IC19.R28)
USB_D5: USB_interface (IC37.22), AFPGA_VME_IO_banks1+3 (IC19.R22)
USB_D6: USB_interface (IC37.23), AFPGA_VME_IO_banks1+3 (IC19.P22)
USB_D7: USB_interface (IC37.24), AFPGA_VME_IO_banks1+3 (IC19.R21)
USB_OE_N: USB_interface (IC37.33), AFPGA_VME_IO_banks1+3 (IC19.Y25)
USB_RD_N: USB_interface (IC37.28), AFPGA_VME_IO_banks1+3 (IC19.T26)
USB_RXF_N: USB_interface (IC37.26), AFPGA_VME_IO_banks1+3 (IC19.T24)
USB_SIWUA: USB_interface (IC37.30), AFPGA_VME_IO_banks1+3 (IC19.U24)
USB_TCK: JTAG chain + SFPGA flash (R246.1), USB_interface (IC37.38 R262.1)
USB_TDI: JTAG chain + SFPGA flash (R248.1), USB_interface (IC37.39 R263.1)
USB_TDO: JTAG chain + SFPGA flash (R247.1), USB_interface (IC37.40 R279.1)
USB_TMS: JTAG chain + SFPGA flash (R243.1), USB_interface (IC37.41 R315.1)
USB_TXE_N: USB_interface (IC37.27), AFPGA_VME_IO_banks1+3 (IC19.T25)
USB_WR_N: USB_interface (IC37.29), AFPGA_VME_IO_banks1+3 (IC19.T27)
USEGA: SFPGA (IC40.G11 R159.1 SW1.6), AFPGA_VME_IO_banks1+3 (IC19.Y22)
VME_A1: SFPGA (IC40.M4), AFPGA_VME_IO_banks1+3 (IC19.AE3), VME_buffers_address (IC22.22)
VME_A2: SFPGA (IC40.M3), AFPGA_VME_IO_banks1+3 (IC19.AE1), VME_buffers_address (IC22.20)
VME_A3: SFPGA (IC40.M5), AFPGA_VME_IO_banks1+3 (IC19.N8), VME_buffers_address (IC22.19)
VME_A4: SFPGA (IC40.N4), AFPGA_VME_IO_banks1+3 (IC19.N7), VME_buffers_address (IC22.16)
VME_A5: SFPGA (IC40.R2), AFPGA_VME_IO_banks1+3 (IC19.AC5), VME_buffers_address (IC22.13)
VME_A6: SFPGA (IC40.R1), AFPGA_VME_IO_banks1+3 (IC19.AC4), VME_buffers_address (IC22.12)
VME_A7: SFPGA (IC40.P2), AFPGA_VME_IO_banks1+3 (IC19.AD4), VME_buffers_address (IC22.9)
VME_A8: SFPGA (IC40.P1), AFPGA_VME_IO_banks1+3 (IC19.AD3), VME_buffers_address (IC21.23)
VME_A9: SFPGA (IC40.N3), AFPGA_VME_IO_banks1+3 (IC19.AB4), VME_buffers_address (IC21.22)
VME_A10: SFPGA (IC40.N1), AFPGA_VME_IO_banks1+3 (IC19.AB3), VME_buffers_address (IC21.20)
VME_A11: SFPGA (IC40.M2), AFPGA_VME_IO_banks1+3 (IC19.AD2), VME_buffers_address (IC21.19)
VME_A12: SFPGA (IC40.M1), AFPGA_VME_IO_banks1+3 (IC19.AD1), VME_buffers_address (IC21.16)
VME_A13: SFPGA (IC40.L3), AFPGA_VME_IO_banks1+3 (IC19.AC3), VME_buffers_address (IC21.13)
VME_A14: SFPGA (IC40.L1), AFPGA_VME_IO_banks1+3 (IC19.AC1), VME_buffers_address (IC21.12)
VME_A15: SFPGA (IC40.K2), AFPGA_VME_IO_banks1+3 (IC19.Y4), VME_buffers_address (IC21.9)
VME_A16: SFPGA (IC40.K1), AFPGA_VME_IO_banks1+3 (IC19.Y3), VME_buffers_address (IC26.23)
VME_A17: SFPGA (IC40.J3), AFPGA_VME_IO_banks1+3 (IC19.Y2), VME_buffers_address (IC26.22)
VME_A18: SFPGA (IC40.J1), AFPGA_VME_IO_banks1+3 (IC19.Y1), VME_buffers_address (IC26.20)
VME_A19: SFPGA (IC40.H2), AFPGA_VME_IO_banks1+3 (IC19.AA5), VME_buffers_address (IC26.19)
VME_A20: SFPGA (IC40.H1), AFPGA_VME_IO_banks1+3 (IC19.AA4), VME_buffers_address (IC26.16)
VME_A21: SFPGA (IC40.G3), AFPGA_VME_IO_banks1+3 (IC19.W3), VME_buffers_address (IC26.13)
VME_A22: SFPGA (IC40.G1), AFPGA_VME_IO_banks1+3 (IC19.W1), VME_buffers_address (IC26.12)
VME_A23: SFPGA (IC40.F2), AFPGA_VME_IO_banks1+3 (IC19.V2), VME_buffers_address (IC26.9)
VME_A24: SFPGA (IC40.F1), AFPGA_VME_IO_banks1+3 (IC19.V1), VME_buffers_address (IC33.9)
VME_A25: SFPGA (IC40.K3), AFPGA_VME_IO_banks1+3 (IC19.U5), VME_buffers_address (IC33.12)
VME_A26: SFPGA (IC40.J4), AFPGA_VME_IO_banks1+3 (IC19.U4), VME_buffers_address (IC33.13)
VME_A27: SFPGA (IC40.H3), AFPGA_VME_IO_banks1+3 (IC19.U3), VME_buffers_address (IC33.16)
VME_A28: SFPGA (IC40.L4), AFPGA_VME_IO_banks1+3 (IC19.U1), VME_buffers_address (IC33.19)
VME_A29: SFPGA (IC40.L5), AFPGA_VME_IO_banks1+3 (IC19.T4), VME_buffers_address (IC33.20)
VME_A30: SFPGA (IC40.E2), AFPGA_VME_IO_banks1+3 (IC19.T3), VME_buffers_address (IC33.22)
VME_A31: SFPGA (IC40.E1), AFPGA_VME_IO_banks1+3 (IC19.T2), VME_buffers_address (IC33.23)
VME_A_DIR: SFPGA (IC40.B2), AFPGA_VME_IO_banks1+3 (IC19.N5), VME_buffers_address (5 pins)
VME_A_OE_N: SFPGA (IC40.K5), AFPGA_VME_IO_banks1+3 (IC19.N4), VME_buffers_address (5 pins)
VME_AM0: SFPGA (IC40.E6), AFPGA_VME_IO_banks1+3 (IC19.AK2), VME_buffers (IC15.9)
VME_AM1: SFPGA (IC40.C7), AFPGA_VME_IO_banks1+3 (IC19.AE4), VME_buffers (IC15.12)
VME_AM2: SFPGA (IC40.A7), AFPGA_VME_IO_banks1+3 (IC19.AF4), VME_buffers (IC15.13)
VME_AM3: SFPGA (IC40.D6), AFPGA_VME_IO_banks1+3 (IC19.AF3), VME_buffers (IC15.16)
VME_AM4: SFPGA (IC40.C6), AFPGA_VME_IO_banks1+3 (IC19.AG3), VME_buffers (IC15.19)
VME_AM5: SFPGA (IC40.B8), AFPGA_VME_IO_banks1+3 (IC19.V8), VME_buffers (IC15.20)
VME_AS_N: SFPGA (IC40.F5), AFPGA_VME_IO_banks1+3 (IC19.P6), VME_buffers_address (IC21.6)
VME_BERR_N: SFPGA (IC40.C1), AFPGA_VME_IO_banks1+3 (IC19.R3), VME_buffers (IC15.41 R211.2)
VME_D0: SFPGA (IC40.P7), AFPGA_VME_IO_banks1+3 (IC19.AA10)
VME_D1: SFPGA (IC40.M7), AFPGA_VME_IO_banks1+3 (IC19.AA9)
VME_D2: SFPGA (IC40.R7), AFPGA_VME_IO_banks1+3 (IC19.AD7)
VME_D3: SFPGA (IC40.T7), AFPGA_VME_IO_banks1+3 (IC19.AE7)
VME_D4: SFPGA (IC40.P6), AFPGA_VME_IO_banks1+3 (IC19.Y9)
VME_D5: SFPGA (IC40.T6), AFPGA_VME_IO_banks1+3 (IC19.Y8)
VME_D6: SFPGA (IC40.R5), AFPGA_VME_IO_banks1+3 (IC19.AE6)
VME_D7: SFPGA (IC40.T5), AFPGA_VME_IO_banks1+3 (IC19.AF6)
VME_D8: SFPGA (IC40.N5), AFPGA_VME_IO_banks1+3 (IC19.W11)
VME_D9: SFPGA (IC40.P5), AFPGA_VME_IO_banks1+3 (IC19.Y11)
VME_D10: SFPGA (IC40.L8), AFPGA_VME_IO_banks1+3 (IC19.AE5)
VME_D11: SFPGA (IC40.L7), AFPGA_VME_IO_banks1+3 (IC19.AG5)
VME_D12: SFPGA (IC40.P4), AFPGA_VME_IO_banks1+3 (IC19.T7)
VME_D13: SFPGA (IC40.T4), AFPGA_VME_IO_banks1+3 (IC19.T6)
VME_D14: SFPGA (IC40.M6), AFPGA_VME_IO_banks1+3 (IC19.AA7)
VME_D15: SFPGA (IC40.N6), AFPGA_VME_IO_banks1+3 (IC19.AA6)
VME_D16: SFPGA (IC40.L10), AFPGA_VME_IO_banks1+3 (IC19.AC6)
VME_D17: SFPGA (IC40.M10), AFPGA_VME_IO_banks1+3 (IC19.AD6)
VME_D18: SFPGA (IC40.R9), AFPGA_VME_IO_banks1+3 (IC19.AH5)
VME_D19: SFPGA (IC40.T9), AFPGA_VME_IO_banks1+3 (IC19.AK5)
VME_D20: SFPGA (IC40.M9), AFPGA_VME_IO_banks1+3 (IC19.W10)
VME_D21: SFPGA (IC40.N8), AFPGA_VME_IO_banks1+3 (IC19.W9)
VME_D22: SFPGA (IC40.P8), AFPGA_VME_IO_banks1+3 (IC19.AB7)
VME_D23: SFPGA (IC40.T8), AFPGA_VME_IO_banks1+3 (IC19.AB6)
VME_D24: SFPGA (IC40.A4), AFPGA_VME_IO_banks1+3 (IC19.W7)
VME_D25: SFPGA (IC40.B5), AFPGA_VME_IO_banks1+3 (IC19.W6)
VME_D26: SFPGA (IC40.A5), AFPGA_VME_IO_banks1+3 (IC19.AJ4)
VME_D27: SFPGA (IC40.D5), AFPGA_VME_IO_banks1+3 (IC19.AK4)
VME_D28: SFPGA (IC40.C5), AFPGA_VME_IO_banks1+3 (IC19.T9)
VME_D29: SFPGA (IC40.B6), AFPGA_VME_IO_banks1+3 (IC19.T8)
VME_D30: SFPGA (IC40.A6), AFPGA_VME_IO_banks1+3 (IC19.AH3)
VME_D31: SFPGA (IC40.F7), AFPGA_VME_IO_banks1+3 (IC19.AK3)
VME_D_DIR: SFPGA (IC40.F4), AFPGA_VME_IO_banks1+3 (IC19.P2)
VME_D_OE_N: SFPGA (IC40.K6), AFPGA_VME_IO_banks1+3 (IC19.P1)
VME_DS1_N: SFPGA (IC40.P9), AFPGA_VME_IO_banks1+3 (IC19.Y6), VME_buffers_address (IC22.3)
VME_DS2_N: SFPGA (IC40.N9), AFPGA_VME_IO_banks1+3 (IC19.Y7), VME_buffers_address (IC22.6)
VME_DTACK_N: SFPGA (IC40.C2), AFPGA_VME_IO_banks1+3 (IC19.R5), VME_buffers_address (IC26.2 R158.2)
VME_DTACK_OE: SFPGA (IC40.C3), AFPGA_VME_IO_banks1+3 (IC19.T1), VME_buffers_address (IC26.48 R166.2)
VME_GA0: SFPGA (IC40.A8), AFPGA_VME_IO_banks1+3 (IC19.V7), VME_buffers (IC27.12)
VME_GA1: SFPGA (IC40.C9), AFPGA_VME_IO_banks1+3 (IC19.AH1), VME_buffers (IC27.13)
VME_GA2: SFPGA (IC40.A9), AFPGA_VME_IO_banks1+3 (IC19.AJ1), VME_buffers (IC27.16)
VME_GA3: SFPGA (IC40.B10), AFPGA_VME_IO_banks1+3 (IC19.V10), VME_buffers (IC27.19)
VME_GA4: SFPGA (IC40.A10), AFPGA_VME_IO_banks1+3 (IC19.V9), VME_buffers (IC27.20)
VME_GAP: SFPGA (IC40.A3), AFPGA_VME_IO_banks1+3 (IC19.M6), VME_buffers (IC27.9)
VME_IACK_N: SFPGA (IC40.E3), AFPGA_VME_IO_banks1+3 (IC19.N1)
VME_IACKIN_N: SFPGA (IC40.F6), AFPGA_VME_IO_banks1+3 (IC19.P7), VME_buffers_address (IC33.3 R209.2)
VME_IACKOUT_N: SFPGA (IC40.E4), AFPGA_VME_IO_banks1+3 (IC19.N3), VME_buffers_address (IC33.5 R209.1)
VME_IRQ1: SFPGA (IC40.E7), AFPGA_VME_IO_banks1+3 (IC19.AG4)
VME_IRQ2: SFPGA (IC40.E8), AFPGA_VME_IO_banks1+3 (IC19.AH4)
VME_IRQ3: SFPGA (IC40.E10), AFPGA_VME_IO_banks1+3 (IC19.N10)
VME_IRQ4: SFPGA (IC40.C10), AFPGA_VME_IO_banks1+3 (IC19.N9)
VME_IRQ5: SFPGA (IC40.D8), AFPGA_VME_IO_banks1+3 (IC19.AF2)
VME_IRQ6: SFPGA (IC40.C8), AFPGA_VME_IO_banks1+3 (IC19.AH2)
VME_IRQ7: SFPGA (IC40.C11), AFPGA_VME_IO_banks1+3 (IC19.R7)
VME_LWORD_N: SFPGA (IC40.B3), AFPGA_VME_IO_banks1+3 (IC19.M7), VME_buffers_address (IC22.23)
VME_RETRY_N: SFPGA (IC40.D1), AFPGA_VME_IO_banks1+3 (IC19.AB2), VME_buffers (IC15.2)
VME_RETRY_OE: SFPGA (IC40.D3), AFPGA_VME_IO_banks1+3 (IC19.R4), VME_buffers (IC15.48 R210.2)
VME_SYSCLK: SFPGA (IC40.G5), AFPGA_VME_IO_banks1+3 (IC19.P3), VME_buffers_address (IC21.3)
VME_SYSRESET_N: SFPGA (IC40.G6), AFPGA_VME_IO_banks1+3 (IC19.P4), VME_buffers (IC15.22)
VME_TCK: SFPGA (IC40.T14), VME_buffers (IC15.23)
VME_TDI: SFPGA (IC40.R12), VME_buffers (IC27.22)
VME_TDO: SFPGA (IC40.T12), VME_buffers (IC27.5)
VME_TDO_OE: SFPGA (IC40.R14), VME_buffers (IC27.41)
VME_TMS: SFPGA (IC40.R15), VME_buffers (IC27.23)
VME_TRST: SFPGA (IC40.T13), VME_buffers (IC27.3)
VME_WRITE_N: SFPGA (IC40.B1), AFPGA_VME_IO_banks1+3 (IC19.R1), VME_buffers_address (IC26.6)
VMEPX_A1: VME_connectors (P1.a30), VME_buffers_address (IC22.27)
VMEPX_A2: VME_connectors (P1.a29), VME_buffers_address (IC22.29)
VMEPX_A3: VME_connectors (P1.a28), VME_buffers_address (IC22.30)
VMEPX_A4: VME_connectors (P1.a27), VME_buffers_address (IC22.33)
VMEPX_A5: VME_connectors (P1.a26), VME_buffers_address (IC22.36)
VMEPX_A6: VME_connectors (P1.a25), VME_buffers_address (IC22.37)
VMEPX_A7: VME_connectors (P1.a24), VME_buffers_address (IC22.40)
VMEPX_A8: VME_connectors (P1.c30), VME_buffers_address (IC21.26)
VMEPX_A9: VME_connectors (P1.c29), VME_buffers_address (IC21.27)
VMEPX_A10: VME_connectors (P1.c28), VME_buffers_address (IC21.29)
VMEPX_A11: VME_connectors (P1.c27), VME_buffers_address (IC21.30)
VMEPX_A12: VME_connectors (P1.c26), VME_buffers_address (IC21.33)
VMEPX_A13: VME_connectors (P1.c25), VME_buffers_address (IC21.36)
VMEPX_A14: VME_connectors (P1.c24), VME_buffers_address (IC21.37)
VMEPX_A15: VME_connectors (P1.c23), VME_buffers_address (IC21.40)
VMEPX_A16: VME_connectors (P1.c22), VME_buffers_address (IC26.26)
VMEPX_A17: VME_connectors (P1.c21), VME_buffers_address (IC26.27)
VMEPX_A18: VME_connectors (P1.c20), VME_buffers_address (IC26.29)
VMEPX_A19: VME_connectors (P1.c19), VME_buffers_address (IC26.30)
VMEPX_A20: VME_connectors (P1.c18), VME_buffers_address (IC26.33)
VMEPX_A21: VME_connectors (P1.c17), VME_buffers_address (IC26.36)
VMEPX_A22: VME_connectors (P1.c16), VME_buffers_address (IC26.37)
VMEPX_A23: VME_connectors (P1.c15), VME_buffers_address (IC26.40)
VMEPX_A24: VME_connectors (P3.b4), VME_buffers_address (IC33.40)
VMEPX_A25: VME_connectors (P3.b5), VME_buffers_address (IC33.37)
VMEPX_A26: VME_connectors (P3.b6), VME_buffers_address (IC33.36)
VMEPX_A27: VME_connectors (P3.b7), VME_buffers_address (IC33.33)
VMEPX_A28: VME_connectors (P3.b8), VME_buffers_address (IC33.30)
VMEPX_A29: VME_connectors (P3.b9), VME_buffers_address (IC33.29)
VMEPX_A30: VME_connectors (P3.b10), VME_buffers_address (IC33.27)
VMEPX_A31: VME_connectors (P3.b11), VME_buffers_address (IC33.26)
VMEPX_AM0: VME_connectors (P1.b16), VME_buffers (IC15.40)
VMEPX_AM1: VME_connectors (P1.b17), VME_buffers (IC15.37)
VMEPX_AM2: VME_connectors (P1.b18), VME_buffers (IC15.36)
VMEPX_AM3: VME_connectors (P1.b19), VME_buffers (IC15.33)
VMEPX_AM4: VME_connectors (P1.a23), VME_buffers (IC15.30)
VMEPX_AM5: VME_connectors (P1.c14), VME_buffers (IC15.29)
VMEPX_AS_N: VME_connectors (P1.a18), VME_buffers_address (IC21.43)
VMEPX_BERR_N: VME_connectors (P1.c11), VME_buffers (IC15.43)
VMEPX_DS1_N: VME_connectors (P1.a12), VME_buffers_address (IC22.46)
VMEPX_DS2_N: VME_connectors (P1.a13), VME_buffers_address (IC22.43)
VMEPX_DTACK_N: VME_connectors (P1.a16), VME_buffers_address (IC26.46)
VMEPX_GA0: VME_connectors (P1.d10), VME_buffers (IC27.37 R216.1)
VMEPX_GA1: VME_connectors (P1.d11), VME_buffers (IC27.36 R217.1)
VMEPX_GA2: VME_connectors (P1.d13), VME_buffers (IC27.33 R223.1)
VMEPX_GA3: VME_connectors (P1.d15), VME_buffers (IC27.30 R228.1)
VMEPX_GA4: VME_connectors (P1.d17), VME_buffers (IC27.29 R230.1)
VMEPX_GAP: VME_connectors (P1.d9), VME_buffers (IC27.40 R213.1)
VMEPX_IACKIN_N: VME_connectors (P1.a21), VME_buffers_address (IC33.46)
VMEPX_IACKOUT_N: VME_connectors (P1.a22), VME_buffers_address (IC33.43)
VMEPX_LWORD_N: VME_connectors (P1.c13), VME_buffers_address (IC22.26)
VMEPX_RETRY_N: VME_connectors (P3.b3), VME_buffers (IC15.46)
VMEPX_SYSCLK: VME_connectors (P1.a10), VME_buffers_address (IC21.46)
VMEPX_SYSRESET: VME_connectors (P1.c12), VME_buffers (IC15.27)
VMEPX_TCK: VME_connectors (P1.z3), VME_buffers (IC15.26)
VMEPX_TDI: VME_connectors (P1.z7), VME_buffers (IC27.27)
VMEPX_TDO: VME_connectors (P1.z5), VME_buffers (IC27.43)
VMEPX_TMS: VME_connectors (P1.z9), VME_buffers (IC27.26)
VMEPX_TRST: VME_connectors (P1.z1), VME_buffers (IC27.46)
VMEPX_WRITE_N: VME_connectors (P1.a14), VME_buffers_address (IC26.43)
WR_LOS: Front_panel (J4.8 R404.1), AFPGA_VME_IO_banks1+3 (IC19.W25)
WR_MODDEF0: Front_panel (J4.6 R403.1), AFPGA_VME_IO_banks1+3 (IC19.Y26)
WR_MODDEF1: Front_panel (J4.5 R402.1), AFPGA_VME_IO_banks1+3 (IC19.Y27)
WR_MODDEF2: Front_panel (J4.4 R401.1), AFPGA_VME_IO_banks1+3 (IC19.AA24)
WR_RATESELECT: Front_panel (R107.2), AFPGA_VME_IO_banks1+3 (IC19.W24)
WR_TXDISABLE: Front_panel (J4.3), AFPGA_VME_IO_banks1+3 (IC19.AA25)
WR_TXFAULT: Front_panel (J4.2 R400.1), AFPGA_VME_IO_banks1+3 (IC19.AA27)